# Altium schematic sheet as14120_usb.SchDoc
size A3; PageSetup: Record=PageOptions|CenterHorizontal=True|CenterVertical=True|PrintScale=0.91|XCorrection=1.00|YCorrection=1.00|PrintKind=0|BorderSize=5000000|LeftOffset=0|BottomOffset=0|Orientation=2|PaperLength=4200|PaperWidth=2970|Scale=100|PaperSource=7|PrintQuality=-4|MediaType=1|DitherType=10|PaperKind=A4 (210 x 297 мм)|PrintScaleMode=1
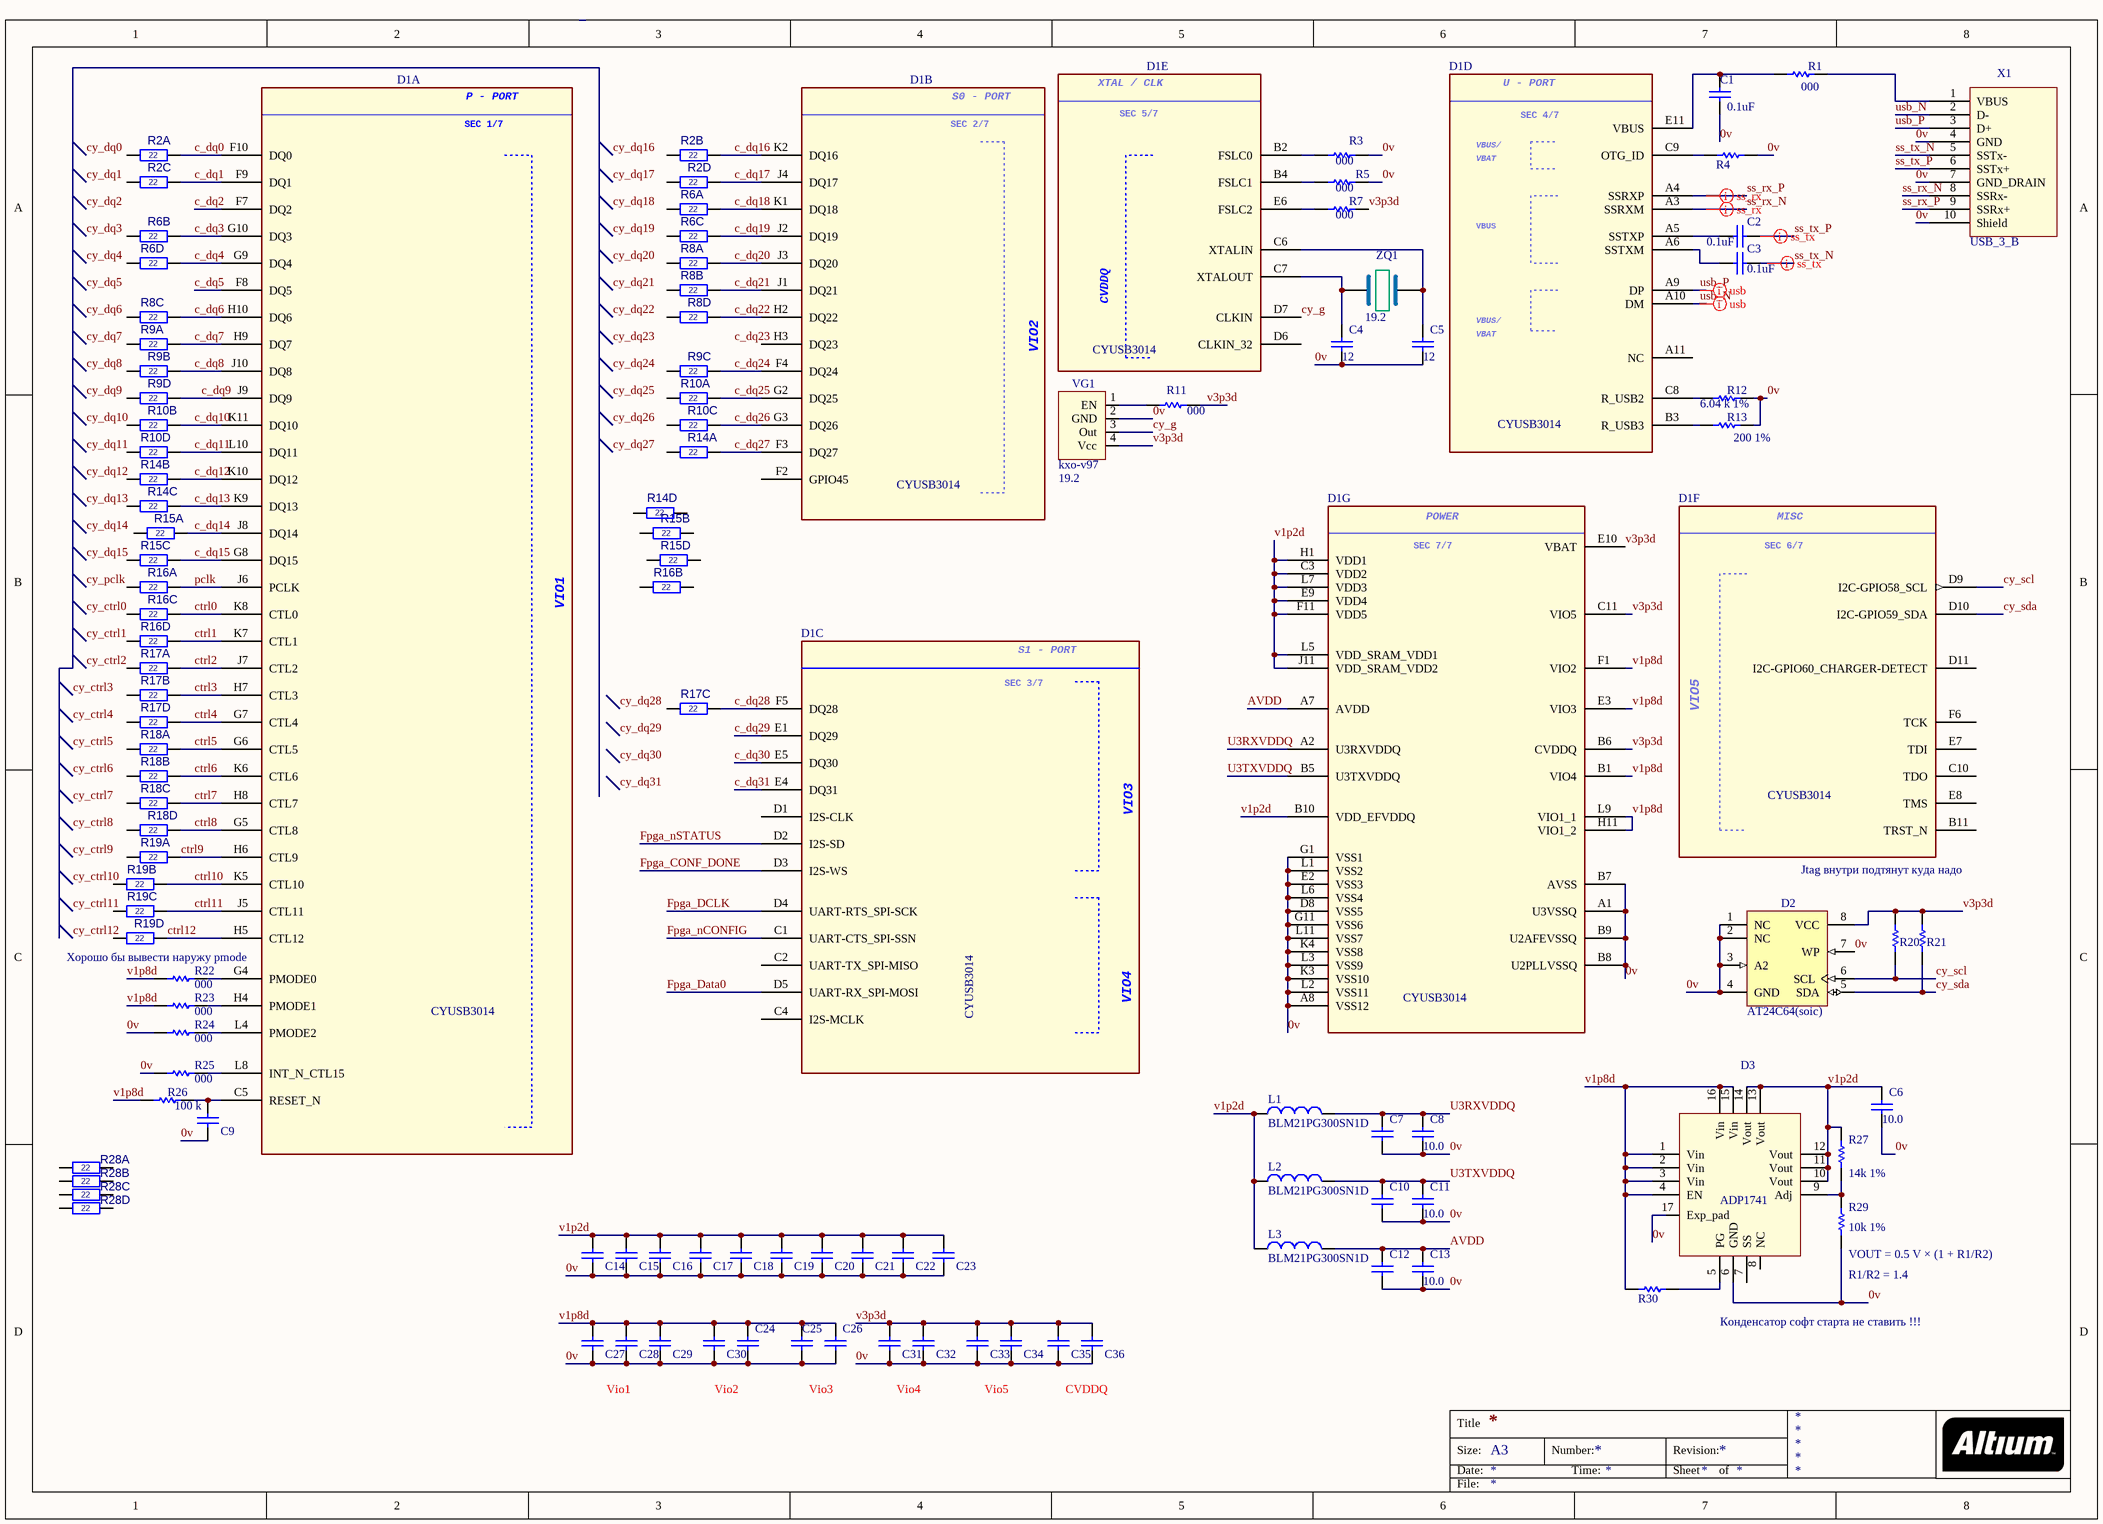
[diagram p0: as14120_usb.SchDoc]

## Parts
C1  value 0.1uF  [CAPC0402(1005)60_M]  (hidden comment: CAP 1uF 10V 0402(1005))
C2  value 0.1uF  [CAPC0402(1005)60_M]  (hidden comment: CAP 1uF 10V 0402(1005))
C3  value 0.1uF  [CAPC0402(1005)60_M]  (hidden comment: CAP 1uF 10V 0402(1005))
C4  value 12  [CAPC0805(2012)100_N]  (hidden comment: CAP_0805)
C5  value 12  [CAPC0805(2012)100_N]  (hidden comment: CAP_0805)
C6  value 10.0  [CAPC0805(2012)100_N]  (hidden comment: CAP_0805)
C7  CAP 1uF 10V 0402(1005)  [CAPC0402(1005)60_M]  (value not drawn)
C8  value 10.0  [CAPC0805(2012)100_N]  (hidden comment: CAP_0805)
C9  CAP 1uF 10V 0402(1005)  [CAPC0402(1005)60_M]  (value not drawn)
C10  CAP 1uF 10V 0402(1005)  [CAPC0402(1005)60_M]  (value not drawn)
C11  value 10.0  [CAPC0805(2012)100_N]  (hidden comment: CAP_0805)
C12  CAP 1uF 10V 0402(1005)  [CAPC0402(1005)60_M]  (value not drawn)
C13  value 10.0  [CAPC0805(2012)100_N]  (hidden comment: CAP_0805)
C14  CAP 1uF 10V 0402(1005)  [CAPC0402(1005)60_M]  (value not drawn)
C15  CAP 1uF 10V 0402(1005)  [CAPC0402(1005)60_M]  (value not drawn)
C16  CAP 1uF 10V 0402(1005)  [CAPC0402(1005)60_M]  (value not drawn)
C17  CAP 1uF 10V 0402(1005)  [CAPC0402(1005)60_M]  (value not drawn)
C18  CAP 1uF 10V 0402(1005)  [CAPC0402(1005)60_M]  (value not drawn)
C19  CAP 1uF 10V 0402(1005)  [CAPC0402(1005)60_M]  (value not drawn)
C20  CAP 1uF 10V 0402(1005)  [CAPC0402(1005)60_M]  (value not drawn)
C21  CAP 1uF 10V 0402(1005)  [CAPC0402(1005)60_M]  (value not drawn)
C22  CAP 1uF 10V 0402(1005)  [CAPC0402(1005)60_M]  (value not drawn)
C23  CAP 1uF 10V 0402(1005)  [CAPC0402(1005)60_M]  (value not drawn)
C24  CAP 1uF 10V 0402(1005)  [CAPC0402(1005)60_M]  (value not drawn)
C25  CAP 1uF 10V 0402(1005)  [CAPC0402(1005)60_M]  (value not drawn)
C26  CAP 1uF 10V 0402(1005)  [CAPC0402(1005)60_M]  (value not drawn)
C27  CAP 1uF 10V 0402(1005)  [CAPC0402(1005)60_M]  (value not drawn)
C28  CAP 1uF 10V 0402(1005)  [CAPC0402(1005)60_M]  (value not drawn)
C29  CAP 1uF 10V 0402(1005)  [CAPC0402(1005)60_M]  (value not drawn)
C30  CAP 1uF 10V 0402(1005)  [CAPC0402(1005)60_M]  (value not drawn)
C31  CAP 1uF 10V 0402(1005)  [CAPC0402(1005)60_M]  (value not drawn)
C32  CAP 1uF 10V 0402(1005)  [CAPC0402(1005)60_M]  (value not drawn)
C33  CAP 1uF 10V 0402(1005)  [CAPC0402(1005)60_M]  (value not drawn)
C34  CAP 1uF 10V 0402(1005)  [CAPC0402(1005)60_M]  (value not drawn)
C35  CAP 1uF 10V 0402(1005)  [CAPC0402(1005)60_M]  (value not drawn)
C36  CAP 1uF 10V 0402(1005)  [CAPC0402(1005)60_M]  (value not drawn)
D1  CYUSB3014  [BGA121C80P11X11]  (parts A,B,C,D,E,F,G of 7)
D2  AT24C64(soic)  [8S1_N]
D3  ADP1741  [CP-16-4_N]
L1  BLM21PG300SN1D  [CAPC0805(2012)100_N]
L2  BLM21PG300SN1D  [CAPC0805(2012)100_N]
L3  BLM21PG300SN1D  [CAPC0805(2012)100_N]
R1  value 000  [RESC0805(2012)_L]  (hidden comment: 1K 1% 0805(2012))
R2  value 22  [CAY16]  (hidden comment: RES_CAY16)  (parts A,B,C,D of 4)
R3  value 000  [RESC0603(1608)_L]  (hidden comment: 1K 5% 0603(1608))
R4  ???  [RESC0603(1608)_L]  (value not drawn)
R5  value 000  [RESC0603(1608)_L]  (hidden comment: 1K 5% 0603(1608))
R6  value 22  [CAY16]  (hidden comment: RES_CAY16)  (parts A,B,C,D of 4)
R7  value 000  [RESC0603(1608)_L]  (hidden comment: 1K 5% 0603(1608))
R8  value 22  [CAY16]  (hidden comment: RES_CAY16)  (parts A,B,C,D of 4)
R9  value 22  [CAY16]  (hidden comment: RES_CAY16)  (parts A,B,C,D of 4)
R10  value 22  [CAY16]  (hidden comment: RES_CAY16)  (parts A,B,C,D of 4)
R11  value 000  [RESC0603(1608)_L]  (hidden comment: 1K 5% 0603(1608))
R12  value 6.04 k 1%  [RESC0805(2012)_L]  (hidden comment: 1K 1% 0805(2012))
R13  value 200 1%  [RESC0805(2012)_L]  (hidden comment: 1K 1% 0805(2012))
R14  value 22  [CAY16]  (hidden comment: RES_CAY16)  (parts A,B,C,D of 4)
R15  value 22  [CAY16]  (hidden comment: RES_CAY16)  (parts A,B,C,D of 4)
R16  value 22  [CAY16]  (hidden comment: RES_CAY16)  (parts A,B,C,D of 4)
R17  value 22  [CAY16]  (hidden comment: RES_CAY16)  (parts A,B,C,D of 4)
R18  value 22  [CAY16]  (hidden comment: RES_CAY16)  (parts A,B,C,D of 4)
R19  value 22  [CAY16]  (hidden comment: RES_CAY16)  (parts A,B,C,D of 4)
R20  1K 5% 0603(1608)  [RESC0603(1608)_L]  (value not drawn)
R21  1K 5% 0603(1608)  [RESC0603(1608)_L]  (value not drawn)
R22  value 000  [RESC0603(1608)_L]  (hidden comment: 1K 5% 0603(1608))
R23  value 000  [RESC0603(1608)_L]  (hidden comment: 1K 5% 0603(1608))
R24  value 000  [RESC0603(1608)_L]  (hidden comment: 1K 5% 0603(1608))
R25  value 000  [RESC0603(1608)_L]  (hidden comment: 1K 5% 0603(1608))
R26  value 100 k  [RESC0603(1608)_L]  (hidden comment: 1K 5% 0603(1608))
R27  value 14k 1%  [RESC0805(2012)_L]  (hidden comment: 1K 1% 0805(2012))
R28  value 22  [CAY16]  (hidden comment: RES_CAY16)  (parts A,B,C,D of 4)
R29  value 10k 1%  [RESC0805(2012)_L]  (hidden comment: 1K 1% 0805(2012))
R30  1K 5% 0603(1608)  [RESC0603(1608)_L]  (value not drawn)
VG1  kxo-v97  value 19.2  [kxo-v97]
X1  USB_3_B  [USB3_B]
ZQ1  value 19.2  [BCY-W2/E4.7]  (hidden comment: Resonator)

## Nets
0v: C1.2 C4.1 C5.1 C6.1 C7.1 C8.1 C9.1 C10.1 C11.1 C12.1 C13.1 C14.1 C15.1 C16.1 C17.1 C18.1 C19.1 C20.1 C21.1 C22.1 C23.1 C24.1 C25.1 C26.1 C27.1 C28.1 C29.1 C30.1 C31.1 C32.1 C33.1 C34.1 C35.1 C36.1 D1.A1(U3VSSQ) D1.A8(VSS12) D1.B7(AVSS) D1.B8(U2PLLVSSQ) D1.B9(U2AFEVSSQ) D1.D8(VSS5) D1.E2(VSS3) D1.G1(VSS1) D1.G11(VSS6) D1.K3(VSS10) D1.K4(VSS8) D1.L1(VSS2) D1.L2(VSS11) D1.L3(VSS9) D1.L6(VSS4) D1.L11(VSS7) D2.1(NC) D2.2(NC) D2.3(A2) D2.4(GND) D2.7(WP) D3.6(GND) D3.17(Exp_pad) R3.1 R4.2 R5.1 R12.2 R13.2 R24.2 R25.2 R29.1 VG1.2(GND) X1.4(GND) X1.7(GND_DRAIN) X1.10(Shield)
AVDD: C12.2 C13.2 D1.A7(AVDD) L3.2
c_dq0: D1.F10(DQ0) R2.8
c_dq1: D1.F9(DQ1) R2.6
c_dq2: D1.F7(DQ2)
c_dq3: D1.G10(DQ3) R6.7
c_dq4: D1.G9(DQ4) R6.8
c_dq5: D1.F8(DQ5)
c_dq6: D1.H10(DQ6) R8.6
c_dq7: D1.H9(DQ7) R9.8
c_dq8: D1.J10(DQ8) R9.7
c_dq9: D1.J9(DQ9) R9.8
c_dq10: D1.K11(DQ10) R10.7
c_dq11: D1.L10(DQ11) R10.8
c_dq12: D1.K10(DQ12) R14.7
c_dq13: D1.K9(DQ13) R14.6
c_dq14: D1.J8(DQ14) R15.8
c_dq15: D1.G8(DQ15) R15.7
c_dq16: D1.K2(DQ16) R2.7
c_dq17: D1.J4(DQ17) R2.5
c_dq18: D1.K1(DQ18) R6.8
c_dq19: D1.J2(DQ19) R6.6
c_dq20: D1.J3(DQ20) R8.7
c_dq21: D1.J1(DQ21) R8.6
c_dq22: D1.H2(DQ22) R8.5
c_dq24: D1.F4(DQ24) R9.7
c_dq25: D1.G2(DQ25) R10.8
c_dq26: D1.G3(DQ26) R10.6
c_dq27: D1.F3(DQ27) R14.8
c_dq28: D1.F5(DQ28) R17.6
c_dq29: D1.E1(DQ29)
c_dq30: D1.E5(DQ30)
c_dq31: D1.E4(DQ31)
ctrl0: D1.K8(CTL0) R16.6
ctrl1: D1.K7(CTL1) R16.5
ctrl2: D1.J7(CTL2) R17.8
ctrl3: D1.H7(CTL3) R17.7
ctrl4: D1.G7(CTL4) R17.5
ctrl5: D1.G6(CTL5) R18.8
ctrl6: D1.K6(CTL6) R18.7
ctrl7: D1.H8(CTL7) R18.7
ctrl8: D1.G5(CTL8) R18.5
ctrl9: D1.H6(CTL9) R19.5
ctrl10: D1.K5(CTL10) R19.7
ctrl11: D1.J5(CTL11) R19.6
ctrl12: D1.H5(CTL12) R19.5
cy_g: D1.D7(CLKIN) VG1.3(Out)
cy_scl: D1.D9(I2C-GPIO58_SCL) D2.6(SCL) R20.1
cy_sda: D1.D10(I2C-GPIO59_SDA) D2.5(SDA) R21.1
Fpga_CONF_DONE: D1.D3(I2S-WS)
Fpga_Data0: D1.D5(UART-RX_SPI-MOSI)
Fpga_DCLK: D1.D4(UART-RTS_SPI-SCK)
Fpga_nCONFIG: D1.C1(UART-CTS_SPI-SSN)
Fpga_nSTATUS: D1.D2(I2S-SD)
pclk: D1.J6(PCLK) R16.8
ss_rx_N: D1.A3(SSRXM) X1.8(SSRx-)
ss_rx_P: D1.A4(SSRXP) X1.9(SSRx+)
ss_tx_N: C3.1 X1.5(SSTx-)
ss_tx_P: C2.1 X1.6(SSTx+)
U3RXVDDQ: C7.2 C8.2 D1.A2(U3RXVDDQ) L1.2
U3TXVDDQ: C10.2 C11.2 D1.B5(U3TXVDDQ) L2.2
usb_N: D1.A10(DM) X1.2(D-)
usb_P: D1.A9(DP) X1.3(D+)
v1p2d: C6.2 C14.2 C15.2 C16.2 C17.2 C18.2 C19.2 C20.2 C21.2 C22.2 C23.2 D1.B10(VDD_EFVDDQ) D1.C3(VDD2) D1.E9(VDD4) D1.F11(VDD5) D1.H1(VDD1) D1.J11(VDD_SRAM_VDD2) D1.L5(VDD_SRAM_VDD1) D1.L7(VDD3) D3.10(Vout) D3.11(Vout) D3.12(Vout) D3.13(Vout) D3.14(Vout) L1.1 L2.1 L3.1 R27.2
v1p8d: C24.2 C25.2 C26.2 C27.2 C28.2 C29.2 C30.2 D1.B1(VIO4) D1.E3(VIO3) D1.F1(VIO2) D1.H11(VIO1_2) D1.L9(VIO1_1) D3.1(Vin) D3.2(Vin) D3.3(Vin) D3.4(EN) D3.15(Vin) D3.16(Vin) R22.2 R23.2 R26.2 R30.2
v3p3d: C31.2 C32.2 C33.2 C34.2 C35.2 C36.2 D1.B6(CVDDQ) D1.C11(VIO5) D1.E10(VBAT) D2.8(VCC) R7.1 R11.1 R20.2 R21.2 VG1.4(Vcc)
NetC1_1: C1.1 D1.E11(VBUS) R1.1
NetC2_2: C2.2 D1.A5(SSTXP)
NetC3_2: C3.2 D1.A6(SSTXM)
NetC4_2: C4.2 D1.C7(XTALOUT) ZQ1.1
NetC5_2: C5.2 D1.C6(XTALIN) ZQ1.2
NetC9_2: C9.2 D1.C5(RESET_N) R26.1
NetD1_B2: D1.B2(FSLC0) R3.2
NetD1_B3: D1.B3(R_USB3) R13.1
NetD1_B4: D1.B4(FSLC1) R5.2
NetD1_C8: D1.C8(R_USB2) R12.1
NetD1_C9: D1.C9(OTG_ID) R4.1
NetD1_E6: D1.E6(FSLC2) R7.2
NetD1_G4: D1.G4(PMODE0) R22.1
NetD1_H4: D1.H4(PMODE1) R23.1
NetD1_L4: D1.L4(PMODE2) R24.1
NetD1_L8: D1.L8(INT_N_CTL15) R25.1
NetD3_5: D3.5(PG) R30.1
NetD3_9: D3.9(Adj) R27.1 R29.2
NetR1_2: R1.2 X1.1(VBUS)
NetR11_2: R11.2 VG1.1(EN)

Not connected (* = marked no-connect by the designer): D1 A11(NC) B11(TRST_N) C2(UART-TX_SPI-MISO) C4(I2S-MCLK) C10(TDO) D1(I2S-CLK) D6(CLKIN_32) D11(I2C-GPIO60_CHARGER-DETECT) E7(TDI) E8(TMS) F2(GPIO45) F6(TCK) H3(DQ23); D3 7(SS) 8(NC); R2 1 2(1) 3(1) 4(1); R6 1 2(1) 3(1) 4(1); R8 1 2(1) 3(1) 4(1); R9 1 2(1) 3(1) 4(1); R10 1 2(1) 3(1) 4(1); R14 1 2(1) 3(1) 4(1) 5(2); R15 1 2(1) 3(1) 4(1) 5(2); R16 1 2(1) 3(1) 4(1) 7(2); R17 1 2(1) 3(1) 4(1); R18 1 2(1) 3(1) 4(1); R19 1 2(1) 3(1) 4(1); R28 1 2(1) 3(1) 4(1) 5(2) 6(2) 7(2) 8(2)

## Layout directives
differential pair: ss_rx_N, ss_rx_P, ss_tx_N, ss_tx_P, usb_N, usb_P

## Notes on the sheet
- Jtag внутри подтянут куда надо
- Хорошо бы вывести наружу pmode
- (near R29) VOUT = 0.5 V × (1 + R1/R2)
- R1/R2 = 1.4
- Конденсатор софт старта не ставить !!!
- Vio1
- Vio2
- Vio3
- Vio4
- Vio5
- CVDDQ
- Labels drawn without touching a wire or pin: c_dq23, cy_ctrl0, cy_ctrl1, cy_ctrl2, cy_ctrl3, cy_ctrl4, cy_ctrl5, cy_ctrl6, cy_ctrl7, cy_ctrl8, cy_ctrl9, cy_ctrl10, cy_ctrl11, cy_ctrl12, cy_dq0, cy_dq1, cy_dq2, cy_dq3, cy_dq4, cy_dq5, cy_dq6, cy_dq7, cy_dq8, cy_dq9, cy_dq10, cy_dq11, cy_dq12, cy_dq13, cy_dq14, cy_dq15, cy_dq16, cy_dq17, cy_dq18, cy_dq19, cy_dq20, cy_dq21, cy_dq22, cy_dq23, cy_dq24, cy_dq25, cy_dq26, cy_dq27, cy_dq28, cy_dq29, cy_dq30, cy_dq31, cy_pclk
- Title
- Size:
- Date:
- A3
- Number:
- Time:
- Revision:
- Sheet
- of
- File:
- (in symbol CYUSB3014-BZXC, part A) P - PORT; SEC 1/7; VIO1
- (in symbol CYUSB3014-BZXC, part B) S0 - PORT; SEC 2/7
- (in symbol CYUSB3014-BZXC, part C) S1 - PORT; SEC 3/7
- (in symbol CYUSB3014-BZXC, part D) U - PORT; SEC 4/7; VBUS/
- (in symbol CYUSB3014-BZXC, part E) XTAL / CLK; SEC 5/7
- (in symbol CYUSB3014-BZXC, part F) MISC; SEC 6/7
- (in symbol CYUSB3014-BZXC, part G) POWER; SEC 7/7

## Library data of the parts
C1-C3 C7 C9 C10 C12 C14-C36 = CAP_0402: CAP 1uF 10V ±20% 0402 (1005 Metric) Thickness 0.6mm SMD; Case-Metric: 1005; Case-EIA: 0402; Tolerance: ±20%; Max Thickness: 0.6 mm; Rated Voltage: 10 V; Technology: SMT
  C7 C9 C10 C12 C14-C36: Value: 1uF
D1 = CYUSB3014-BZXC
D2 = AT24C08BN-SP25-T: 8Kbit (1024 x 8), 2-wire Bus Automotive Serial EEPROM with Write Protect, 2.5V, 8-Pin SOIC, Tape & Reel; DatasheetVersion: 8517C,  Jan-2009; PackageVersion: revC, Mar-2005; PackageReference: 8S1; PackageDescription: 8-Lead (0.150" Wide Body), Plastic Gull Wing Small Outline (JEDEC SOIC); Code_JEDEC: MS-012-AA; Code_IPC: SOIC127P600-8; ComponentLink1Description: Manufacturer URL; ComponentLink1URL: http://www.atmel.com/; ComponentLink2Description: Datasheet; ComponentLink2URL: http://www.atmel.com/dyn/resources/prod_documents/doc8517.pdf
L1-L3 = Ferrite_beat
R1 R12 R13 R27 R29 = RES_0805: 1K 0.125W 1% 0805 (2012 Metric)  SMD; Case-Metric: 2012; Case-EIA: 0805; Tolerance: 1 %; Power: 0.125 W; Technology: SMT
R3-R5 R7 R11 R22-R26 = RES_0603: 1K 0.1W 5% 0603 (1608 Metric)  SMD; Case-EIA: 0603; Case-Metric: 1608; Technology: SMT; Tolerance: 5 %; Power: 0.1 W
  R4: Value: ???
R20 R21 = RES_0603: 1K 0.1W 5% 0603 (1608 Metric)  SMD; Case-EIA: 0603; Case-Metric: 1608; Value: 2.2 k; Technology: SMT; Tolerance: 5 %; Power: 0.1 W
R30 = RES_0603: 1K 0.1W 5% 0603 (1608 Metric)  SMD; Case-EIA: 0603; Case-Metric: 1608; Value: 100k; Technology: SMT; Tolerance: 5 %; Power: 0.1 W